# Altium schematic sheet TSAL23-ESF-3.SchDoc
size A4
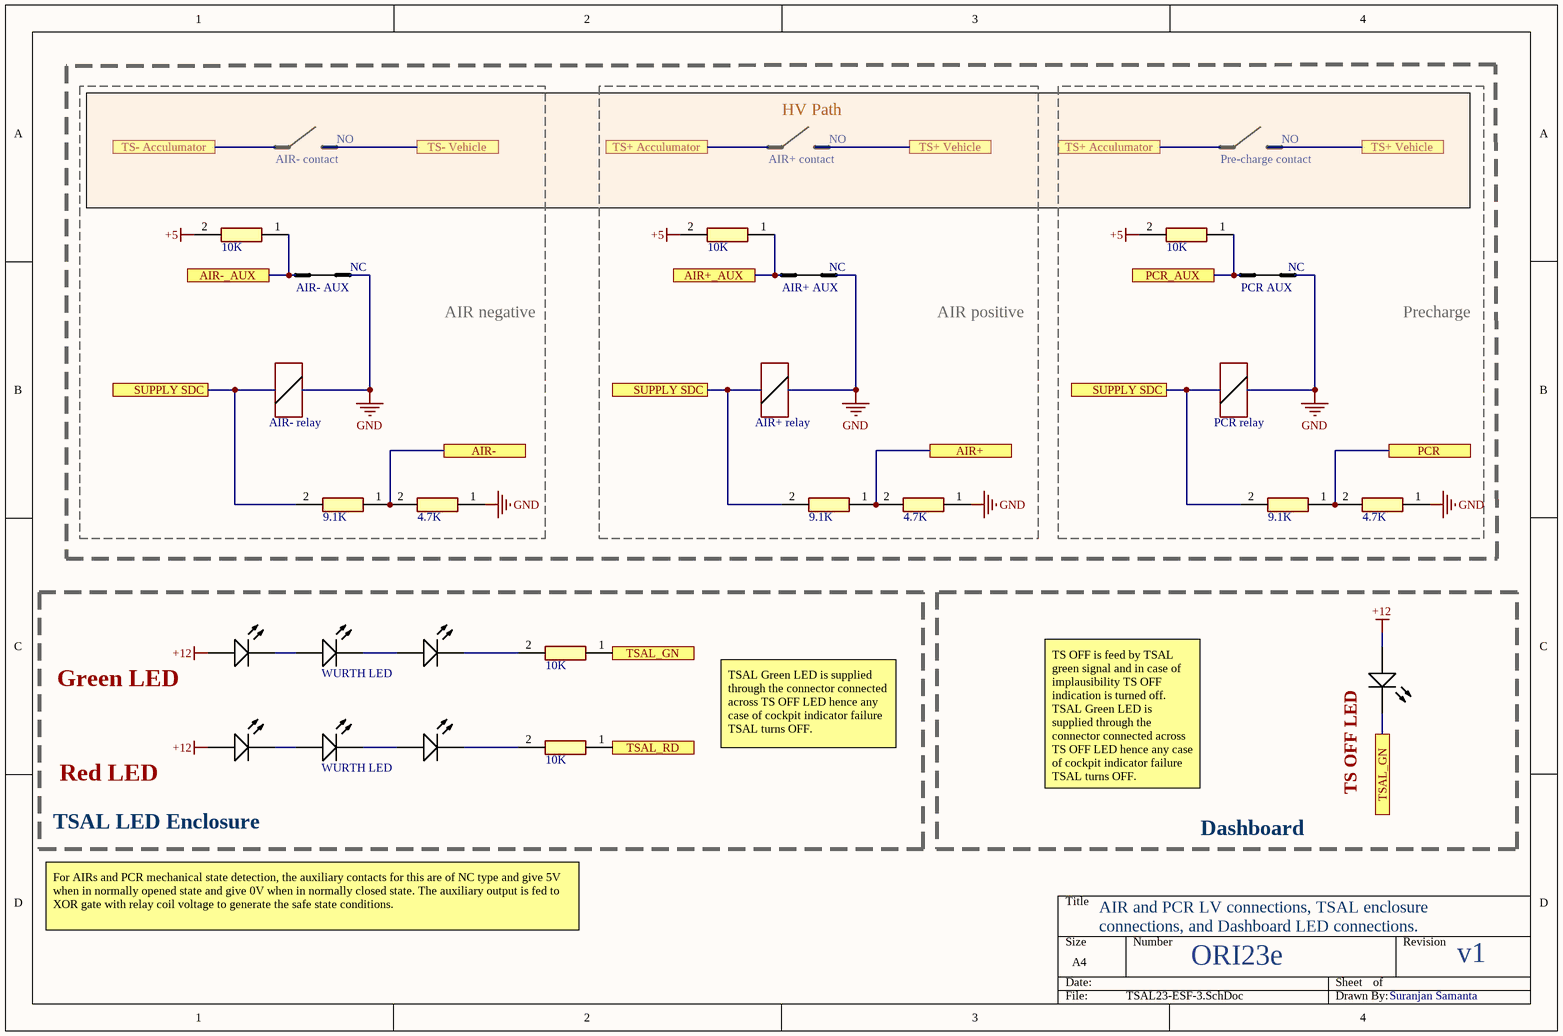
[diagram p0: TSAL23-ESF-3.SchDoc]

## Parts
(Parts that share a designator on the sheet are numbered #1, #2 ... from top to bottom, then left to right.)
?#1  WURTH LED  [AVAG-HSMW-C191_V]  (value not drawn)
?#2  WURTH LED  [AVAG-HSMW-C191_V]
?#3  WURTH LED  [AVAG-HSMW-C191_V]  (value not drawn)
?#4  WURTH LED  [AVAG-HSMW-C191_V]  (value not drawn)
?#5  WURTH LED  [AVAG-HSMW-C191_V]  (value not drawn)
?#6  WURTH LED  [AVAG-HSMW-C191_V]
?#7  WURTH LED  [AVAG-HSMW-C191_V]  (value not drawn)
R?#1  10K  [RESC3126X60N]
R?#2  10K  [RESC3126X60N]
R?#3  10K  [RESC3126X60N]
R?#4  9.1K  [RESC3126X60N]
R?#5  4.7K  [RESC3126X60N]
R?#6  9.1K  [RESC3126X60N]
R?#7  4.7K  [RESC3126X60N]
R?#8  9.1K  [RESC3126X60N]
R?#9  4.7K  [RESC3126X60N]
R?#10  10K  [RESC3126X60N]
R?#11  10K  [RESC3126X60N]

## Blocks framed on the sheet
AIR negative: R?#1 R?#4 R?#5
Precharge: R?#3 R?#8 R?#9
Dashboard: ?#4

## Ports
AIR+, AIR+_AUX, AIR-, AIR-_AUX, PCR, PCR_AUX, SUPPLY SDC, TS+ Acculumator, TS+ Vehicle, TS- Acculumator, TS- Vehicle, TSAL_GN, TSAL_RD

## Nets
+5: R?#1.2 R?#2.2 R?#3.2
+12: ?#1.1(A) ?#4.1(A) ?#5.1(A)
GND: R?#5.1 R?#7.1 R?#9.1
AIR+: R?#6.1 R?#7.2 ; port AIR+
AIR+_AUX: R?#2.1 ; port AIR+_AUX
AIR-: R?#4.1 R?#5.2 ; port AIR-
AIR-_AUX: R?#1.1 ; port AIR-_AUX
PCR: R?#8.1 R?#9.2 ; port PCR
PCR_AUX: R?#3.1 ; port PCR_AUX
SUPPLY SDC: R?#4.2 R?#6.2 R?#8.2 ; port SUPPLY SDC
TSAL_GN: ?#4.2(K) R?#10.1 ; port TSAL_GN
TSAL_RD: R?#11.1 ; port TSAL_RD
Net?#1_2: ?#1.2(K) ?#2.1(A)
Net?#2_2: ?#2.2(K) ?#3.1(A)
Net?#3_2: ?#3.2(K) R?#10.2
Net?#5_2: ?#5.2(K) ?#6.1(A)
Net?#6_2: ?#6.2(K) ?#7.1(A)
Net?#7_2: ?#7.2(K) R?#11.2

## Notes on the sheet
- HV Path
- AIR- contact
- NO
- AIR+ contact
- Pre-charge contact
- AIR- AUX
- NC
- AIR+ AUX
- PCR AUX
- AIR positive
- AIR- relay
- AIR+ relay
- PCR relay
- Green LED
- Red LED
- TSAL Green LED is supplied through the connector connected across TS OFF LED hence any case of cockpit indicator failure TSAL turns OFF.
- TS OFF is feed by TSAL green signal and in case of implausibility TS OFF indication is turned off.
  TSAL Green LED is supplied through the connector connected across TS OFF LED hence any case of cockpit indicator failure TSAL turns OFF.
- (near ?#4) TS OFF LED
- TSAL LED Enclosure
- For AIRs and PCR mechanical state detection, the auxiliary contacts for this are of NC type and give 5V when in normally opened state and give 0V when in normally closed state. The auxiliary output is fed to XOR gate with relay coil voltage to generate the safe state conditions.
- AIR and PCR LV connections, TSAL enclosure connections, and Dashboard LED connections.
- ORI23e
- v1
- Suranjan Samanta

## Library data of the parts
?#1-?#7 = CMP-1744-00001-1: LED Uni-Color White, 78 mW, 20 mA, -40 to 85 degC, 2-Pin SMD, RoHS, Tape and Reel; Current Rating: 300 mA; Contact Plating: Silver; Width: 12 mm; Package Quantity: 560; ComponentLink2URL: http://docs.avagotech.com/docs/AV02-0186EN; ComponentLink1URL: http://www.avagotech.com/; RoHSCompliant: true; PackageDescription: 2-Pin Surface Mount Device, Body 1.6 x 0.8 mm; Contact Material: Copper; ComponentLink1Description: Manufacturer URL; Mount: Through Hole; Packaging: Bulk; DatasheetVersion: May-10; Height: 12 mm; ComponentLink2Description: Datasheet; Contact Finish: Silver; Max Operating Temperature: 85 degC; Radiation Hardening: No; PackageReference: HSMW-C191; REACH SVHC: Unknown; Min Operating Temperature: -20 degC; Length: 16 mm
R?#1-R?#11 = RC1210JR-0710KL: Resistor; Manufacturer_Name: YAGEO (PHYCOMP); Datasheet Link: http://www.yageo.com/documents/recent/PYu-RC1210_51_RoHS_L_(4).pdf; Height: 0.6mm; Manufacturer_Part_Number: RC1210JR-0710KL; Mouser Part Number: 603-RC1210JR-0710KL; Mouser Price/Stock: https://www.mouser.com/Search/Refine.aspx?Keyword=603-RC1210JR-0710KL